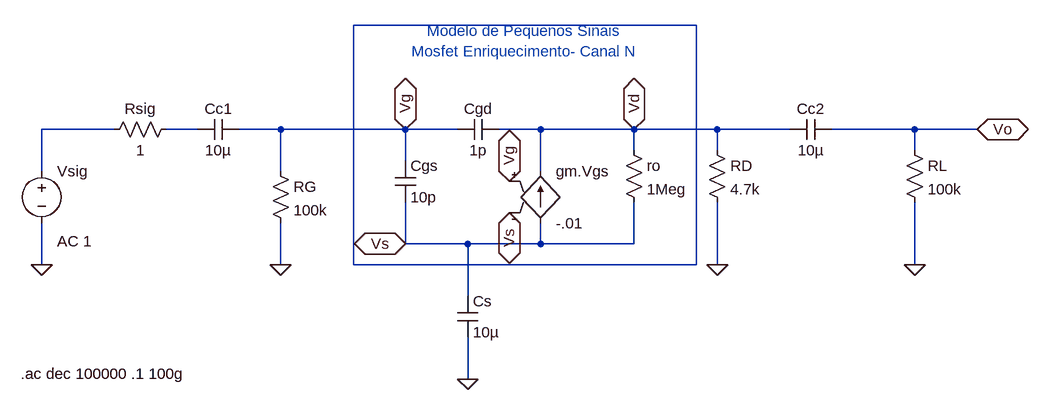
[diagram p0: schematic Fonte_Comum_Todas_Frequencias.asc]
Fonte_Comum_Todas_Frequencias.asc, the LTspice schematic file:
Version 4
SHEET 1 1560 680
WIRE 1040 -80 512 -80
WIRE 144 80 32 80
WIRE 272 80 224 80
WIRE 400 80 336 80
WIRE 592 80 400 80
WIRE 672 80 592 80
WIRE 800 80 736 80
WIRE 944 80 800 80
WIRE 1072 80 944 80
WIRE 1184 80 1072 80
WIRE 1376 80 1248 80
WIRE 1472 80 1376 80
WIRE 944 112 944 80
WIRE 1072 112 1072 80
WIRE 1376 112 1376 80
WIRE 592 128 592 80
WIRE 32 144 32 80
WIRE 400 144 400 80
WIRE 800 144 800 80
WIRE 592 256 592 192
WIRE 688 256 592 256
WIRE 800 256 800 224
WIRE 800 256 688 256
WIRE 944 256 944 192
WIRE 944 256 800 256
WIRE 32 288 32 224
WIRE 400 288 400 224
WIRE 512 288 512 -80
WIRE 1040 288 1040 -80
WIRE 1040 288 512 288
WIRE 1072 288 1072 192
WIRE 1376 288 1376 192
WIRE 688 336 688 256
WIRE 688 464 688 400
FLAG 32 288 0
FLAG 400 288 0
FLAG 688 464 0
FLAG 752 160 Vg
IOPIN 752 160 BiDir
FLAG 752 208 Vs
IOPIN 752 208 BiDir
FLAG 592 80 Vg
IOPIN 592 80 BiDir
FLAG 592 256 Vs
IOPIN 592 256 BiDir
FLAG 1072 288 0
FLAG 1376 288 0
FLAG 1472 80 Vo
IOPIN 1472 80 BiDir
FLAG 944 80 Vd
IOPIN 944 80 BiDir
SYMBOL voltage 32 128 R0
WINDOW 123 24 124 Left 2
WINDOW 39 0 0 Left 0
SYMATTR Value2 AC 1
SYMATTR InstName Vsig
SYMATTR Value ""
SYMBOL res 240 64 R90
WINDOW 0 0 56 VBottom 2
WINDOW 3 32 56 VTop 2
SYMATTR InstName Rsig
SYMATTR Value 1
SYMBOL cap 336 64 R90
WINDOW 0 0 32 VBottom 2
WINDOW 3 32 32 VTop 2
SYMATTR InstName Cc1
SYMATTR Value 10µ
SYMBOL res 384 128 R0
SYMATTR InstName RG
SYMATTR Value 100k
SYMBOL g 800 128 R0
SYMATTR InstName gm.Vgs
SYMATTR Value -.01
SYMBOL cap 672 336 R0
SYMATTR InstName Cs
SYMATTR Value 10µ
SYMBOL res 1056 96 R0
SYMATTR InstName RD
SYMATTR Value 4.7k
SYMBOL res 1360 96 R0
SYMATTR InstName RL
SYMATTR Value 100k
SYMBOL res 928 96 R0
SYMATTR InstName ro
SYMATTR Value 1Meg
SYMBOL cap 1248 64 R90
WINDOW 0 0 32 VBottom 2
WINDOW 3 32 32 VTop 2
SYMATTR InstName Cc2
SYMATTR Value 10µ
SYMBOL cap 576 128 R0
SYMATTR InstName Cgs
SYMATTR Value 10p
SYMBOL cap 736 64 R90
WINDOW 0 0 32 VBottom 2
WINDOW 3 32 32 VTop 2
SYMATTR InstName Cgd
SYMATTR Value 1p
TEXT 0 456 Left 2 !.ac dec 100000 .1 100g
TEXT 776 -56 Center 2 ;Modelo de Pequenos Sinais\nMosfet Enriquecimento- Canal N

The netlist it stands for:
* Fonte_Comum_Todas_Frequencias.asc
Vsig N002 0 AC 1
Rsig N003 N002 1
Cc1 Vg N003 10µ
RG Vg 0 100k
gm.Vgs Vs Vd Vg Vs -.01
Cs Vs 0 10µ
RD Vd 0 4.7k
RL Vo 0 100k
ro Vd Vs 1Meg
Cc2 Vo Vd 10µ
Cgs Vg Vs 10p
Cgd Vd Vg 1p
.ac dec 100000 .1 100g
* Modelo de Pequenos Sinais
* Mosfet Enriquecimento- Canal N
.backanno
.end